# Altium schematic sheet main.SchDoc
size A
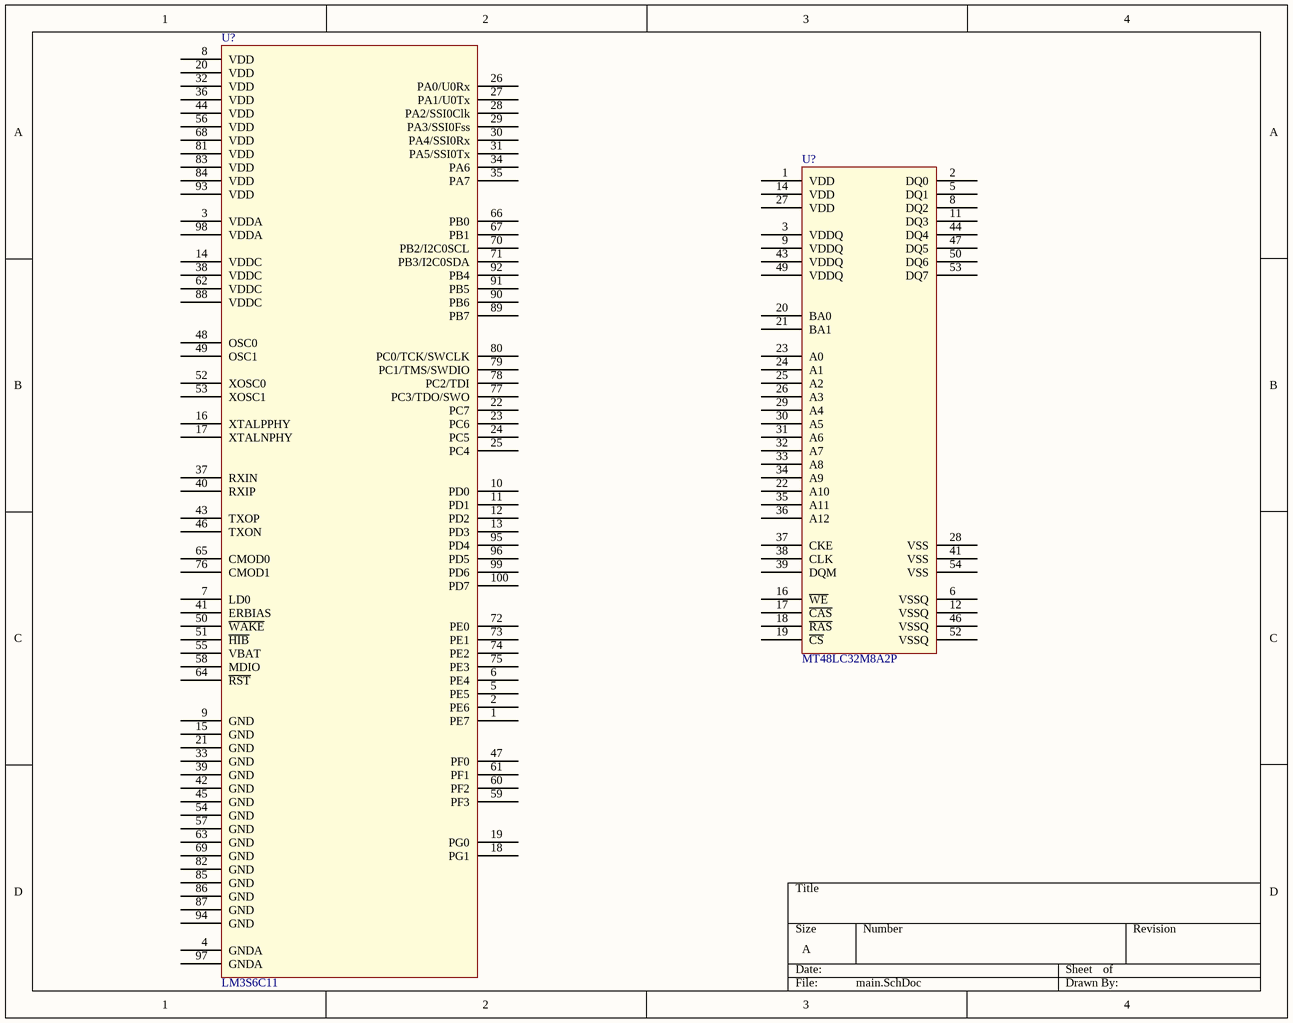
[diagram p0: main.SchDoc]

## Parts
(Parts that share a designator on the sheet are numbered #1, #2 ... from top to bottom, then left to right.)
U?#1  MT48LC32M8A2P
U?#2  LM3S6C11

## Nets

Not connected (* = marked no-connect by the designer): U?#1 1(VDD) 2(DQ0) 3(VDDQ) 4(NC) 5(DQ1) 6(VSSQ) 7(NC) 8(DQ2) 9(VDDQ) 10(NC) 11(DQ3) 12(VSSQ) 13(NC) 14(VDD) 15(NC) 16(~{WE}) 17(~{CAS}) 18(~{RAS}) 19(~{CS}) 20(BA0) 21(BA1) 22(A10) 23(A0) 24(A1) 25(A2) 26(A3) 27(VDD) 28(VSS) 29(A4) 30(A5) 31(A6) 32(A7) 33(A8) 34(A9) 35(A11) 36(A12) 37(CKE) 38(CLK) 39(DQM) 40(NC) 41(VSS) 42(NC) 43(VDDQ) 44(DQ4) 45(NC) 46(VSSQ) 47(DQ5) 48(NC) 49(VDDQ) 50(DQ6) 51(NC) 52(VSSQ) 53(DQ7) 54(VSS); U?#2 1(PE7) 2(PE6) 3(VDDA) 4(GNDA) 5(PE5) 6(PE4) 7(LD0) 8(VDD) 9(GND) 10(PD0) 11(PD1) 12(PD2) 13(PD3) 14(VDDC) 15(GND) 16(XTALPPHY) 17(XTALNPHY) 18(PG1) 19(PG0) 20(VDD) 21(GND) 22(PC7) 23(PC6) 24(PC5) 25(PC4) 26(PA0/U0Rx) 27(PA1/U0Tx) 28(PA2/SSI0Clk) 29(PA3/SSI0Fss) 30(PA4/SSI0Rx) 31(PA5/SSI0Tx) 32(VDD) 33(GND) 34(PA6) 35(PA7) 36(VDD) 37(RXIN) 38(VDDC) 39(GND) 40(RXIP) 41(ERBIAS) 42(GND) 43(TXOP) 44(VDD) 45(GND) 46(TXON) 47(PF0) 48(OSC0) 49(OSC1) 50(~{WAKE}) 51(~{HIB}) 52(XOSC0) 53(XOSC1) 54(GND) 55(VBAT) 56(VDD) 57(GND) 58(MDIO) 59(PF3) 60(PF2) 61(PF1) 62(VDDC) 63(GND) 64(~{RST}) 65(CMOD0) 66(PB0) 67(PB1) 68(VDD) 69(GND) 70(PB2/I2C0SCL) 71(PB3/I2C0SDA) 72(PE0) 73(PE1) 74(PE2) 75(PE3) 76(CMOD1) 77(PC3/TDO/SWO) 78(PC2/TDI) 79(PC1/TMS/SWDIO) 80(PC0/TCK/SWCLK) 81(VDD) 82(GND) 83(VDD) 84(VDD) 85(GND) 86(GND) 87(GND) 88(VDDC) 89(PB7) 90(PB6) 91(PB5) 92(PB4) 93(VDD) 94(GND) 95(PD4) 96(PD5) 97(GNDA) 98(VDDA) 99(PD6) 100(PD7)

## Library data of the parts
U?#1 = MT48LC32M8A2P: 254M (32Mx8) DDR SDRAM
U?#2 = LM3S6C11: Stellaris ARM Cortex M3 microcontroller.